# Altium schematic sheet ADC.SchDoc
size Tabloid
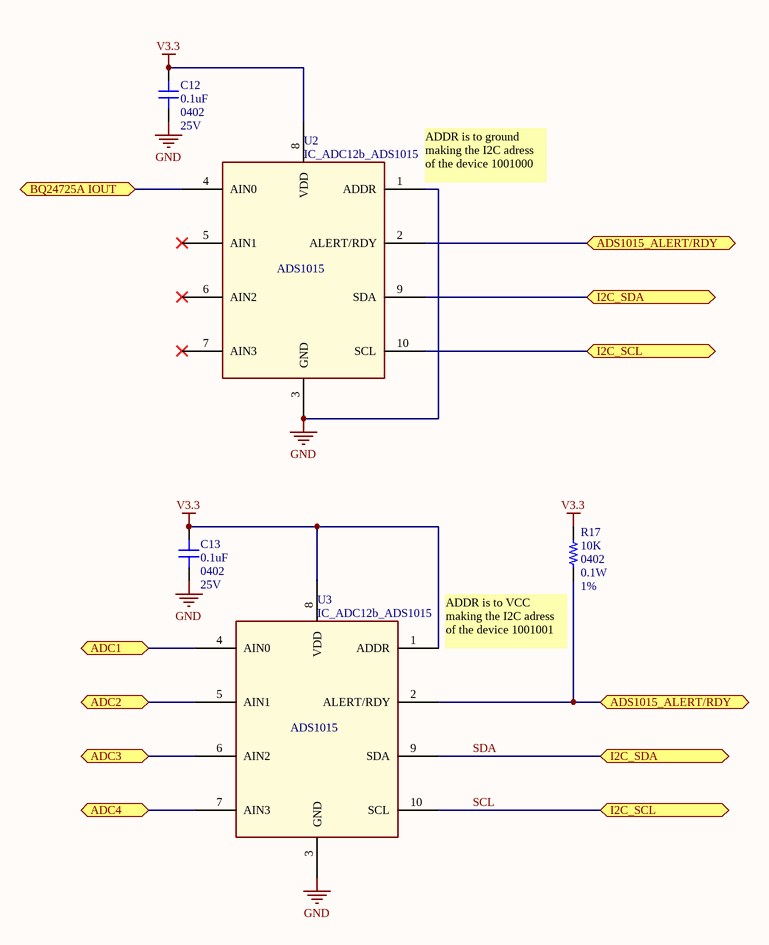
[diagram p0: ADC.SchDoc]

## Parts
C12  value 0.1uF  Package: 0402  Voltage: 25V  [CAP_0402]  (hidden comment: CAP_‎‎CL05A104KA5NNNC‎)
C13  value 0.1uF  Package: 0402  Voltage: 25V  [CAP_0402]  (hidden comment: CAP_‎‎CL05A104KA5NNNC‎)
R17  value 10K  Package: 0402  Power: 0.1W  Tolerance: 1%  [RES_0402]  (hidden comment: RES_‎MCS0402MC1002FE000‎)
U2  IC_ADC12b_ADS1015  [ADS1015]
U3  IC_ADC12b_ADS1015  [ADS1015]

## Ports
ADC1, ADC2, ADC3, ADC4, ADS1015_ALERT/RDY, BQ24725A IOUT, I2C_SCL, I2C_SDA

## Nets
GND: C12.2 C13.2 U2.1(ADDR) U2.3(GND) U3.3(GND)
V3.3: C12.1 C13.1 R17.1 U2.8(VDD) U3.1(ADDR) U3.8(VDD)
ADC1: U3.4(AIN0) ; port ADC1
ADC2: U3.5(AIN1) ; port ADC2
ADC3: U3.6(AIN2) ; port ADC3
ADC4: U3.7(AIN3) ; port ADC4
ADS1015_ALERT/RDY: R17.2 U2.2(ALERT/RDY) U3.2(ALERT/RDY) ; port ADS1015_ALERT/RDY
BQ24725A IOUT: U2.4(AIN0) ; port BQ24725A IOUT
SCL: U2.10(SCL) U3.10(SCL) ; port I2C_SCL
SDA: U2.9(SDA) U3.9(SDA) ; port I2C_SDA

Not connected (* = marked no-connect by the designer): U2 5(AIN1)* 6(AIN2)* 7(AIN3)*

## Notes on the sheet
- (near U2) ADDR is to ground making the I2C adress of the device 1001000
- (near R17) ADDR is to VCC making the I2C adress of the device 1001001
- Sheet Name
- Project Title
- Global Project
- Size
- Group
- Revision
- Date
- Sheet
- of
- Filename
- Designers

## Library data of the parts
C12 C13 = CAP_‎‎CL05A104KA5NNNC‎: CAP CER 0.1uF 25V 0402; Part number: CL05A104KA5NNNC‎
R17 = RES_‎MCS0402MC1002FE000‎: RES 10K 1% 1/10W 0402; Part number: ‎MCS0402MC1002FE000‎
U2 U3 = IC_ADC12b_ADS1015: ADC 12-bits with Internal Reference, Oscillator, and Programmable Comparator; Part number: ADS1015